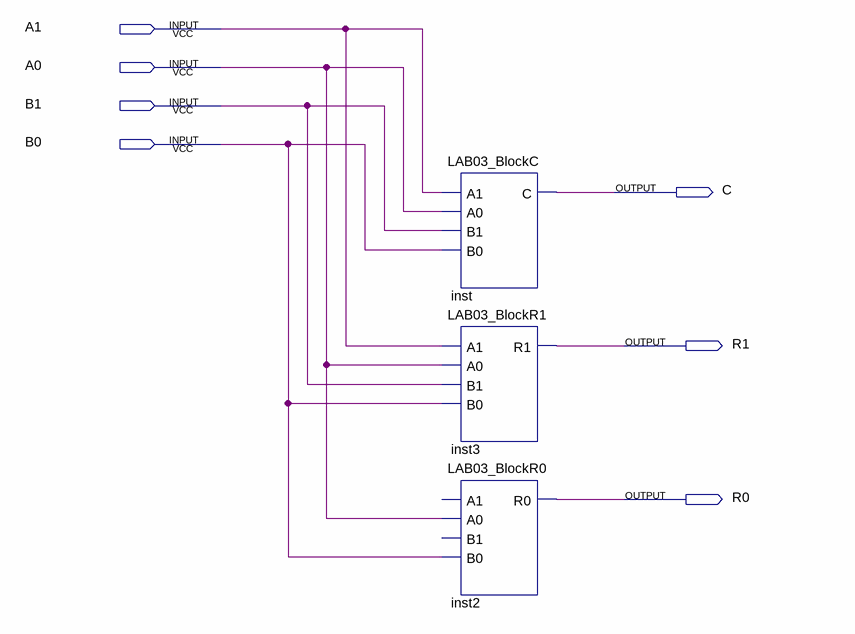
[diagram p0: schematic sheet]
// Quartus schematic LAB03_AllBlock.bdf as structural Verilog: 3 symbols, 7 pins
module LAB03_AllBlock (
  input  A1,
  input  A0,
  input  B1,
  input  B0,
  output C,
  output R1,
  output R0
);

  LAB03_BlockC inst (.A1(A1), .A0(A0), .B1(B1), .B0(B0), .C(C));
  LAB03_BlockR1 inst3 (.A1(A1), .A0(A0), .B1(B1), .B0(B0), .R1(R1));
  LAB03_BlockR0 inst2 (.A0(A0), .B0(B0), .R0(R0));  // open: A1, B1
endmodule
